# Altium schematic sheet MCU_v2.SchDoc
size A3
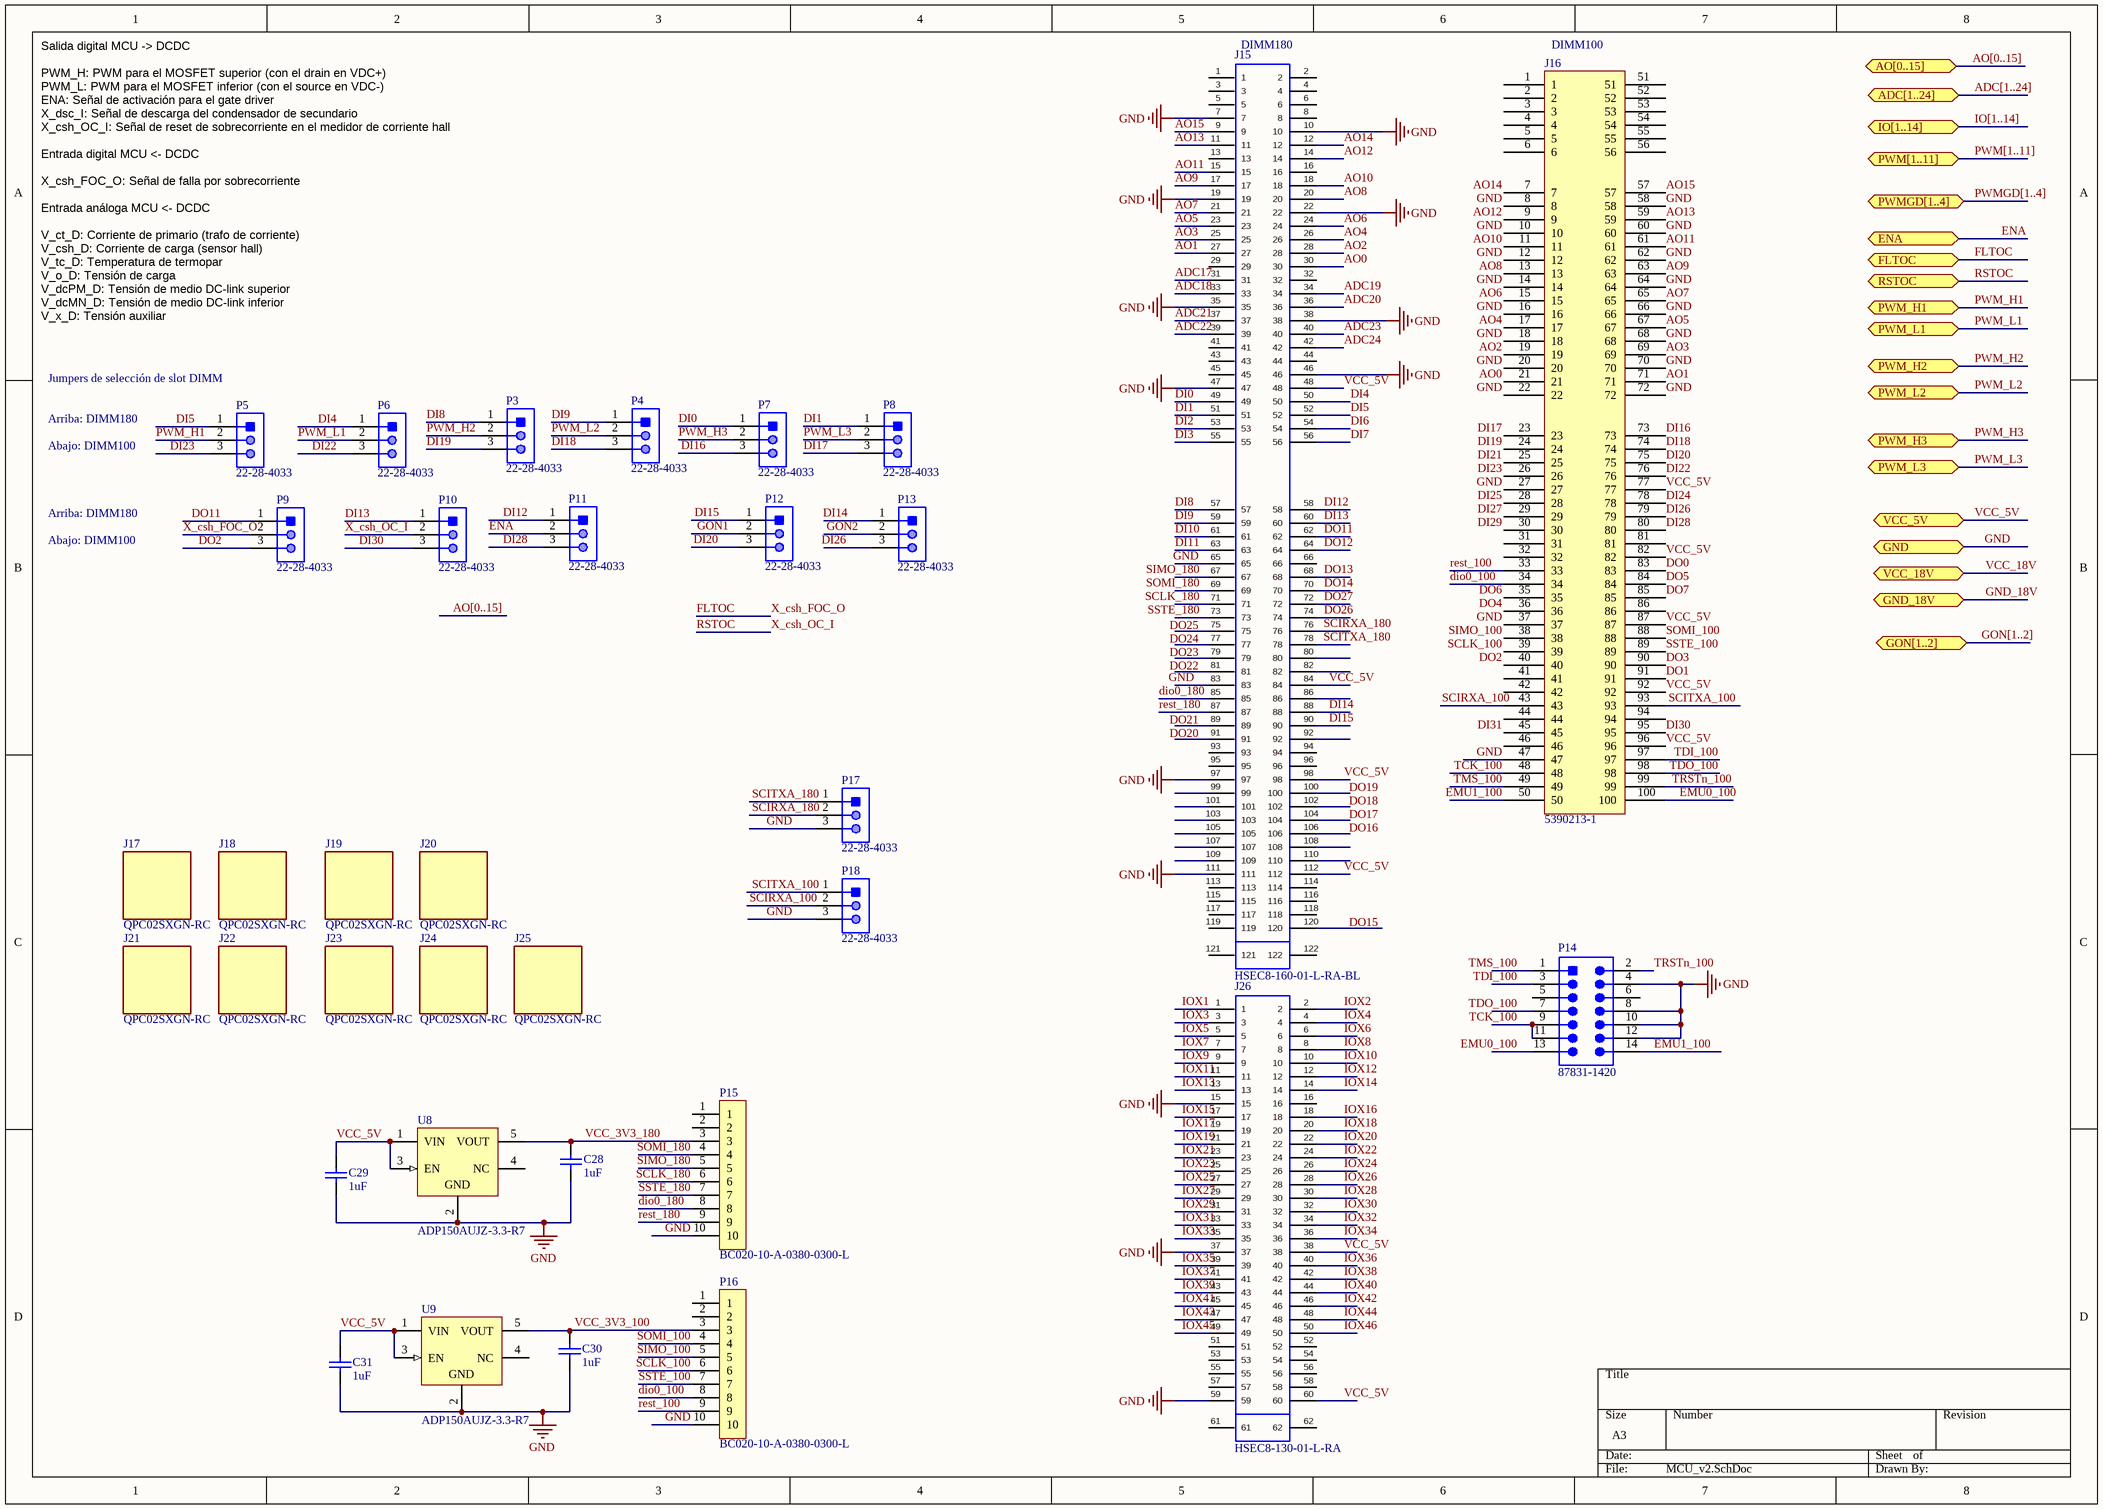
[diagram p0: MCU_v2.SchDoc]

## Parts
C28  value 1uF  [CAPC0603(1608)100_N]  (hidden comment: CAP 1uF 50V 0603(1608))
C29  value 1uF  [CAPC0603(1608)100_N]  (hidden comment: CAP 1uF 50V 0603(1608))
C30  value 1uF  [CAPC0603(1608)100_N]  (hidden comment: CAP 1uF 50V 0603(1608))
C31  value 1uF  [CAPC0603(1608)100_N]  (hidden comment: CAP 1uF 50V 0603(1608))
J15  HSEC8-160-01-L-RA-BL  [HSEC8-160-01-L-RA-BL]
J16  5390213-1  [TE_5390213-1]
J17  QPC02SXGN-RC  [FP-QPC02SXGN-RC-MFG]
J18  QPC02SXGN-RC  [FP-QPC02SXGN-RC-MFG]
J19  QPC02SXGN-RC  [FP-QPC02SXGN-RC-MFG]
J20  QPC02SXGN-RC  [FP-QPC02SXGN-RC-MFG]
J21  QPC02SXGN-RC  [FP-QPC02SXGN-RC-MFG]
J22  QPC02SXGN-RC  [FP-QPC02SXGN-RC-MFG]
J23  QPC02SXGN-RC  [FP-QPC02SXGN-RC-MFG]
J24  QPC02SXGN-RC  [FP-QPC02SXGN-RC-MFG]
J25  QPC02SXGN-RC  [FP-QPC02SXGN-RC-MFG]
J26  HSEC8-130-01-L-RA  [HSEC8-130-01-L-RA]
P3  22-28-4033  [MOLX-22-28-4033_V]
P4  22-28-4033  [MOLX-22-28-4033_V]
P5  22-28-4033  [MOLX-22-28-4033_V]
P6  22-28-4033  [MOLX-22-28-4033_V]
P7  22-28-4033  [MOLX-22-28-4033_V]
P8  22-28-4033  [MOLX-22-28-4033_V]
P9  22-28-4033  [MOLX-22-28-4033_V]
P10  22-28-4033  [MOLX-22-28-4033_V]
P11  22-28-4033  [MOLX-22-28-4033_V]
P12  22-28-4033  [MOLX-22-28-4033_V]
P13  22-28-4033  [MOLX-22-28-4033_V]
P14  87831-1420  [MOLEX-87831-1420_V]
P15  BC020-10-A-0380-0300-L  [BC020-10-A-0380-0300-L]
P16  BC020-10-A-0380-0300-L  [BC020-10-A-0380-0300-L]
P17  22-28-4033  [MOLX-22-28-4033_V]
P18  22-28-4033  [MOLX-22-28-4033_V]
U8  ADP150AUJZ-3.3-R7  [ADI-UJ-5_M]
U9  ADP150AUJZ-3.3-R7  [ADI-UJ-5_M]

## Ports
ADC[1..24] (bidir), AO[0..15] (bidir), ENA (bidir), FLTOC (bidir), GND (bidir), GND_18V (bidir), GON[1..2] (bidir), IO[1..14] (bidir), PWM[1..11] (bidir), PWM_H1 (bidir), PWM_H2 (bidir), PWM_H3 (bidir), PWM_L1 (bidir), PWM_L2 (bidir), PWM_L3 (bidir), PWMGD[1..4] (bidir), RSTOC (bidir), VCC_5V (bidir), VCC_18V (bidir)

## Nets
GND: C28.1 C29.1 C30.1 C31.1 J15.7 J15.10 J15.19 J15.22 J15.35 J15.38 J15.46 J15.47 J15.65 J15.83 J15.97 J15.111 J16.8 J16.10 J16.12 J16.14 J16.16 J16.18 J16.20 J16.22 J16.27 J16.37 J16.47 J16.58 J16.60 J16.62 J16.64 J16.66 J16.68 J16.70 J16.72 J26.15 J26.37 J26.59 P14.4 P14.8 P14.10 P14.12 P15.10 P16.10 P17.3 P18.3 U8.2(GND) U9.2(GND) ; port GND
ADC17: J15.31
ADC18: J15.33
ADC19: J15.34
ADC20: J15.36
ADC21: J15.37
ADC22: J15.39
ADC23: J15.40
ADC24: J15.42
AO0: J15.30 J16.21
AO1: J15.27 J16.71
AO2: J15.28 J16.19
AO3: J15.25 J16.69
AO4: J15.26 J16.17
AO5: J15.23 J16.67
AO6: J15.24 J16.15
AO7: J15.21 J16.65
AO8: J15.20 J16.13
AO9: J15.17 J16.63
AO10: J15.18 J16.11
AO11: J15.15 J16.61
AO12: J15.14 J16.9
AO13: J15.11 J16.59
AO14: J15.12 J16.7
AO15: J15.9 J16.57
DI0: J15.49 P7.1
DI1: J15.51 P8.1
DI2: J15.53
DI3: J15.55
DI4: J15.50 P6.1
DI5: J15.52 P5.1
DI6: J15.54
DI7: J15.56
DI8: J15.57 P3.1
DI9: J15.59 P4.1
DI10: J15.61
DI11: J15.63
DI12: J15.58 P11.1
DI13: J15.60 P10.1
DI14: J15.88 P13.1
DI15: J15.90 P12.1
DI16: J16.73 P7.3
DI17: J16.23 P8.3
DI18: J16.74 P4.3
DI19: J16.24 P3.3
DI20: J16.75 P12.3
DI21: J16.25
DI22: J16.76 P6.3
DI23: J16.26 P5.3
DI24: J16.78
DI25: J16.28
DI26: J16.79 P13.3
DI27: J16.29
DI28: J16.80 P11.3
DI29: J16.30
DI30: J16.95 P10.3
DI31: J16.45
dio0_100: J16.34 P16.8
dio0_180: J15.85 P15.8
DO0: J16.83
DO1: J16.91
DO2: J16.40 P9.3
DO3: J16.90
DO4: J16.36
DO5: J16.84
DO6: J16.35
DO7: J16.85
DO11: J15.62 P9.1
DO12: J15.64
DO13: J15.68
DO14: J15.70
DO26: J15.74
DO27: J15.72
EMU0_100: J16.100 P14.13
EMU1_100: J16.50 P14.14
ENA: P11.2 ; port ENA
FLTOC: P9.2 ; port FLTOC  [also labelled X_csh_FOC_O]
GND_18V: port GND_18V
GON1: P12.2
GON2: P13.2
IOX1: J26.1
IOX2: J26.2
IOX3: J26.3
IOX4: J26.4
IOX5: J26.5
IOX6: J26.6
IOX7: J26.7
IOX8: J26.8
IOX9: J26.9
IOX10: J26.10
IOX11: J26.11
IOX12: J26.12
IOX13: J26.13
IOX14: J26.14
IOX15: J26.17
IOX16: J26.18
IOX17: J26.19
IOX18: J26.20
IOX19: J26.21
IOX20: J26.22
IOX21: J26.23
IOX22: J26.24
IOX23: J26.25
IOX24: J26.26
IOX25: J26.27
IOX26: J26.28
IOX27: J26.29
IOX28: J26.30
IOX29: J26.31
IOX30: J26.32
IOX31: J26.33
IOX32: J26.34
IOX33: J26.35
IOX34: J26.36
IOX35: J26.39
IOX36: J26.40
IOX37: J26.41
IOX38: J26.42
IOX39: J26.43
IOX40: J26.44
IOX41: J26.45
IOX42: J26.46
IOX43: J26.47
IOX44: J26.48
IOX45: J26.49
IOX46: J26.50
PWM_H1: P5.2 ; port PWM_H1
PWM_H2: P3.2 ; port PWM_H2
PWM_H3: P7.2 ; port PWM_H3
PWM_L1: P6.2 ; port PWM_L1
PWM_L2: P4.2 ; port PWM_L2
PWM_L3: P8.2 ; port PWM_L3
rest_100: J16.33 P16.9
rest_180: J15.87 P15.9
RSTOC: P10.2 ; port RSTOC  [also labelled X_csh_OC_I]
SCIRXA_100: J16.43 P18.2
SCIRXA_180: J15.76 P17.2
SCITXA_100: J16.93 P18.1
SCITXA_180: J15.78 P17.1
SCLK_100: J16.39 P16.6
SCLK_180: J15.71 P15.6
SIMO_100: J16.38 P16.5
SIMO_180: J15.67 P15.5
SOMI_100: J16.88 P16.4
SOMI_180: J15.69 P15.4
SSTE_100: J16.89 P16.7
SSTE_180: J15.73 P15.7
TCK_100: J16.48 P14.9 P14.11
TDI_100: J16.97 P14.3
TDO_100: J16.98 P14.7
TMS_100: J16.49 P14.1
TRSTn_100: J16.99 P14.2
VCC_3V3_100: C30.2 P16.3 U9.5(VOUT)
VCC_3V3_180: C28.2 P15.3 U8.5(VOUT)
VCC_5V: C29.2 C31.2 J15.48 J15.84 J15.98 J15.112 J16.77 J16.82 J16.87 J16.92 J16.96 J26.38 J26.60 U8.1(VIN) U8.3(EN) U9.1(VIN) U9.3(EN) ; port VCC_5V
VCC_18V: port VCC_18V

Not connected (* = marked no-connect by the designer): J15 1 2 3 4 5 6 8 13 16 29 32 41 43 44 45 66 75 77 79 80 81 82 86 89 91 92 93 94 95 96 99 100 101 102 103 104 105 106 107 108 109 110 113 114 115 116 117 118 119 120 121 122; J16 1 2 3 4 5 6 31 32 41 42 44 46 51 52 53 54 55 56 81 86 94; J26 16 51 52 53 54 55 56 57 58 61 62; P14 5 6; P15 1 2; P16 1 2; U8 4(NC); U9 4(NC)

## Buses and harness runs
bus ADC[1..24] = port ADC[1..24]
bus AO[0..15]
bus AO[0..15] = port AO[0..15]
bus GON[1..2] = port GON[1..2]
bus IO[1..14] = port IO[1..14]
bus PWM[1..11] = port PWM[1..11]
bus PWMGD[1..4] = port PWMGD[1..4]

## Notes on the sheet
- (near J15) DIMM180
- (near J16) DIMM100
- Salida digital MCU -> DCDC
  PWM_H: PWM para el MOSFET superior (con el drain en VDC+)
  PWM_L: PWM para el MOSFET inferior (con el source en VDC-)
  ENA: Señal de activación para el gate driver
  X_dsc_I: Señal de descarga del condensador de secundario
  X_csh_OC_I: Señal de reset de sobrecorriente en el medidor de corriente hall
  Entrada digital MCU <- DCDC
  X_csh_FOC_O: Señal de falla por sobrecorriente
  Entrada análoga MCU <- DCDC
  V_ct_D: Corriente de primario (trafo de corriente)
  V_csh_D: Corriente de carga (sensor hall)
  V_tc_D: Temperatura de termopar
  V_o_D: Tensión de carga
  V_dcPM_D: Tensión de medio DC-link superior
  V_dcMN_D: Tensión de medio DC-link inferior
  V_x_D: Tensión auxiliar
- (near P5) Jumpers de selección de slot DIMM
- Arriba: DIMM180
- Abajo: DIMM100
- Labels drawn without touching a wire or pin: DO15, DO16, DO17, DO18, DO19, DO20, DO21, DO22, DO23, DO24, DO25

## Library data of the parts
C28-C31 = CMP-1035-02746-1: CAP 1uF 50V ±20% 0603 (1608 Metric) Thickness 1mm SMD; Tolerance: Â±20%; Case-EIA: 0603; Case-Metric: 1608; Technology: SMT; Max Thickness: 1 mm; Rated Voltage: 50 V
J15 = HSEC8-160-01-L-RA-BL: Standard Card Edge Connectors 0.80 mm Edge Rate High-Speed Edge Card Connector, Vertical; Manufacturer: Samtec; Number of Contacts: 120; Pitch: 0.8mm; Supplier 1: Digi-Key; Manufacturer Part Number: HSEC8-160-01-L-RA-BL; RoHS: Yes; Category: Card Edge Connectors; Stock 1: 48; Pricing 1: 1=13.09000, 10=11.90000, 25=11.60240, 50=10.71000, 100=10.11500, 250=9.22252, 500=8.62750, 1000=7.91350, 2500=7.73500 (USD); Mount: Surface Mount; Contact Plating: Gold; Number of Rows: 2; Termination: Solder; Packaging: Bulk; Radiation Hardening: No; ComponentLink1URL: https://datasheet.ciiva.com/10927/hsec8-ra-10927470.pdf?src-supplier=Avnet; ComponentLink1Description: https://datasheet.ciiva.com/10927/hsec8-ra-10927470.pdf?src-supplier=Avnet; Supplier Part Number 1: SAM13312-ND
J16 = 5390213-1: 100 Position DIMM DRAM Socket Through Hole; Centerline_Pitch: 1.27 mm[.05 in]; MF: TE Connectivity; Number_of_Positions: 100; SnapEDA_Link: https://www.snapeda.com/parts/5390213-1/TE%20Connectivity%20AMP%20Connectors/view-part/781316/?ref=snap; MP: 5390213-1; TE_purchase_URL: https://www.te.com/usa-en/product-5390213-1.html?te_bu=Cor&te_type=disp&te_campaign=seda_glo_cor-seda-global-disp-prtnr-fy19-seda-model-bom-cta_sma-317_1&elqCampaignId=32493; Availability: Unavailable; EU_RoHS_Compliance: Compliant; Price: None; Product_Type: Socket; Package: None; Value: *; Supplier 1: Newark; Supplier 2: Digi-Key; Supplier 3: Mouser; Supplier Part Number 1: 42K7163; Supplier Part Number 2: A121375-ND; Supplier Part Number 3: 571-5390213-1
J17-J25 = CMP-25666-000001-1: CONN JUMPER SHORTING .100" GOLD; Manufacturer: Sullins; Conn Orientation: Straight; Pitch: 2.54mm; Current Rating: 3A; Number Of Contacts: 2; Category: Conn; Temperature Range Low: -40°C; Temperature Range High: +85°C; Device Class L1: Connectors; Lead Free: Yes; Manufacturer Part Number: QPC02SXGN-RC; Automotive: No; Height: 6.17mm; ComponentLink2URL: https://s3.amazonaws.com/catalogspreads-pdf/PAGE128-129%20.100%20JUMPER.pdf; Device Class L2: unset; Footprint Url: https://drawings-pdf.s3.amazonaws.com/11510.pdf; Device Class L3: unset; Temperature: -40°C to +85°C; RoHS: TRUE; Digikey Description: CONN JUMPER SHORTING .100" GOLD; Octopart: https://octopart.com/qpc02sxgn-rc-sullins-19878795; Package: 0; ComponentLink2Description: Datasheet; Contact Material: Gold
J26 = HSEC8-130-01-L-RA: SAMTEC - HSEC8-130-01-L-RA - CARD EDGE CONN, DUAL SIDE, 60POS, SMD; Number of Contacts: 60; Pitch: 0.8mm; Supplier 1: Digi-Key; Manufacturer: Samtec; Manufacturer Part Number: HSEC8-130-01-L-RA; RoHS: Yes; Category: Card Edge Connectors; Stock 1: 105; Pricing 1: 1=8.35000, 10=8.00400, 25=7.30800, 50=6.96000, 100=6.61200, 250=5.91600, 500=5.56800, 1000=4.87200, 2500=4.62840 (USD); Mount: Surface Mount; Contact Plating: Gold; Termination: Solder; Packaging: Bulk; Number of Rows: 2; Radiation Hardening: No; ComponentLink1URL: https://datasheet.ciiva.com/3101/hsec8-ra-3101230.pdf?src-supplier=Avnet; ComponentLink1Description: https://datasheet.ciiva.com/3101/hsec8-ra-3101230.pdf?src-supplier=Avnet; Supplier Part Number 1: SAM12638-ND
P3-P13 P17 P18 = CMP-1676-00001-5: Male Header, Pitch 2.54 mm, 1 x 3 Position, Height 8.38 mm, Tail Length 3.18 mm, RoHS, Bulk; Manufacturer: Molex; Rows: 1; Voltage Rating: 250 V; Current Rating: 4 A; Min Operating Temperature: 0 degC; Lead Pitch: 0.1 inch; Packaging: Bulk; Contact Finish: Gold; RoHSCompliant: true; Contact Material: Brass; PackageReference: 22-28-4033; REACH SVHC: Unknown; PackageDescription: Male Header, Pitch 2.54 mm, 1 x 3 Position, Height 8.38 mm, Tail Length 3.18 mm; ComponentLink2URL: http://www.molex.com/pdm_docs/sd/022284033_sd.pdf; Height: 8.38 mm; Mounting Technology: Through Hole; ComponentLink1Description: Manufacturer URL; Length: 7.62 mm; Mount: Through Hole; DatasheetVersion: Rev. G, 01/2012; Max Operating Temperature: 75 degC; ComponentLink2Description: Datasheet; Colour: Black; Pins: 3; Contact Plating: Gold; Package Quantity: 1; ComponentLink1URL: http://www.molex.com/
P14 = CMP-2000-05240-1: Header, Pitch 2 mm, 2 x 7 Position, Height 6.4 mm, Tail Length 2.5 mm, -55 to 105 degC, RoHS, Tube; Number of Positions / Contacts: 14; Current Rating: 2A; Brand: Molex; Mounting Angle: Vertical; Pitch: 2mm; Voltage Rating: 125V; Datasheet Version: Rev. E, 04/2006; Housing Material: Thermoplastic; Contact Material: Brass; Datasheet URL: https://datasheet.ciiva.com/27096/1934585-27096088.pdf; Type: Shrouded; Number of Positions: 14; Mounting Style: ThroughHole; Product Category: Headers&WireHousings; RoHS: Details; Factory Pack Quantity: 3200; Contact Plating: Gold; Series: 87831; Number of Rows: 2; Manufacturer: Molex; Product Type: Headers; Termination Style: ThroughHole; Packaging: Tube; Tradename: Milli-Grid; Manufacturer URL: http://www.molex.com/
P15 P16 = BC020-10-A-0380-0300-L: BOARD-BOARD CONNECTOR, HEADER, 10WAY, 1ROW; Product Range:BC020 Series; Contact Termination Type:Through Hole; Gender:Header; No. of Contacts:10; Pitch Spacing:1mm; Contact Plating:Gold Plated Contacts; Contact Material:Copper Alloy ;RoHS Compliant: Yes; Manufacturer: Global Connector Technology; Gender: Male; Number of Contacts: 10; Manufacturer Part Number: BC020-10-A-0380-0300-L; RoHS: Yes; Category: Connectors; Stock 1: 1113; Pricing 1: 1=0,66300, 10=0,66300, 25=0,66300, 50=0,66300, 100=0,66300, 250=0,66300, 500=0,66300, 1000=0,66300 (USD); Mount: Through Hole; Contact Plating: Gold; Contact Material: Copper Alloy; Termination: Through Hole; Number of Rows: 1; REACH SVHC: No SVHC; ComponentLink1URL: http://www.farnell.com/datasheets/2342914.pdf?src-supplier=Farnell; ComponentLink1Description: http://www.farnell.com/datasheets/2342914.pdf?src-supplier=Farnell; ComponentLink2URL: http://www.farnell.com/datasheets/682675.pdf?src-supplier=Farnell; ComponentLink2Description: http://www.farnell.com/datasheets/682675.pdf?src-supplier=Farnell; ComponentLink3URL: http://www.farnell.com/datasheets/682675.pdf?src-supplier=Element14; ComponentLink3Description: http://www.farnell.com/datasheets/682675.pdf?src-supplier=Element14; Supplier 1: Newark; Supplier 2: Farnell; Supplier 3: Newark; Supplier Part Number 1: 67R6873; Supplier Part Number 2: 2577320; Supplier Part Number 3: 42AC9863; System: Connector
U8 U9 = CMP-0786-00394-1: Ultralow Noise, 150 mA CMOS Linear Regulator, 2.2 to 5.5 V Vin, 3.3 V Vout, Industrial, 5-pin SOT23 (UJ-5), Reel; Manufacturer: Analog Devices; Supply Current IGND @ Small Load: 10uA; Vin (min) (V): 2.2; Iout max: 150mA; Preset Vout Values (V): 3.3; Vin (max) (V): 5.5; ComponentLink2Description: Datasheet; PackageReference: UJ-5; DatasheetVersion: Rev. A; PackageDescription: 5-Pin Thin Small Outline Transistor Package, Body 2.9 x 1.6 mm, Pitch 0.95 mm; ComponentLink4URL: Product URL:http://www.analog.com/en/ADP150/productSearch.html; Packing: Reel; ComponentLink1URL: http://www.analog.com/en/index.html; PartNumber: ADP150AUJZ-3.3-R7; PackageVersion: 100708-A, 10/2008; ComponentLink3Description: Package Specification; ComponentLink3URL: http:/www.analog.com/static/imported-files/packages/PKG_PDF/TSOT(UJ)/UJ_5.pdf; ComponentLink4Description: URL Link1; ComponentLink2URL: http://www.analog.com/static/imported-files/data_sheets/ADP150.pdf; Code_JEDEC: MO-193-AB; Mounting Technology: Surface Mount; ComponentLink1Description: Manufacturer URL